# Altium schematic sheet JETSON_V2.SchDoc
size D; SheetNumber: 7; SheetTotal: 19
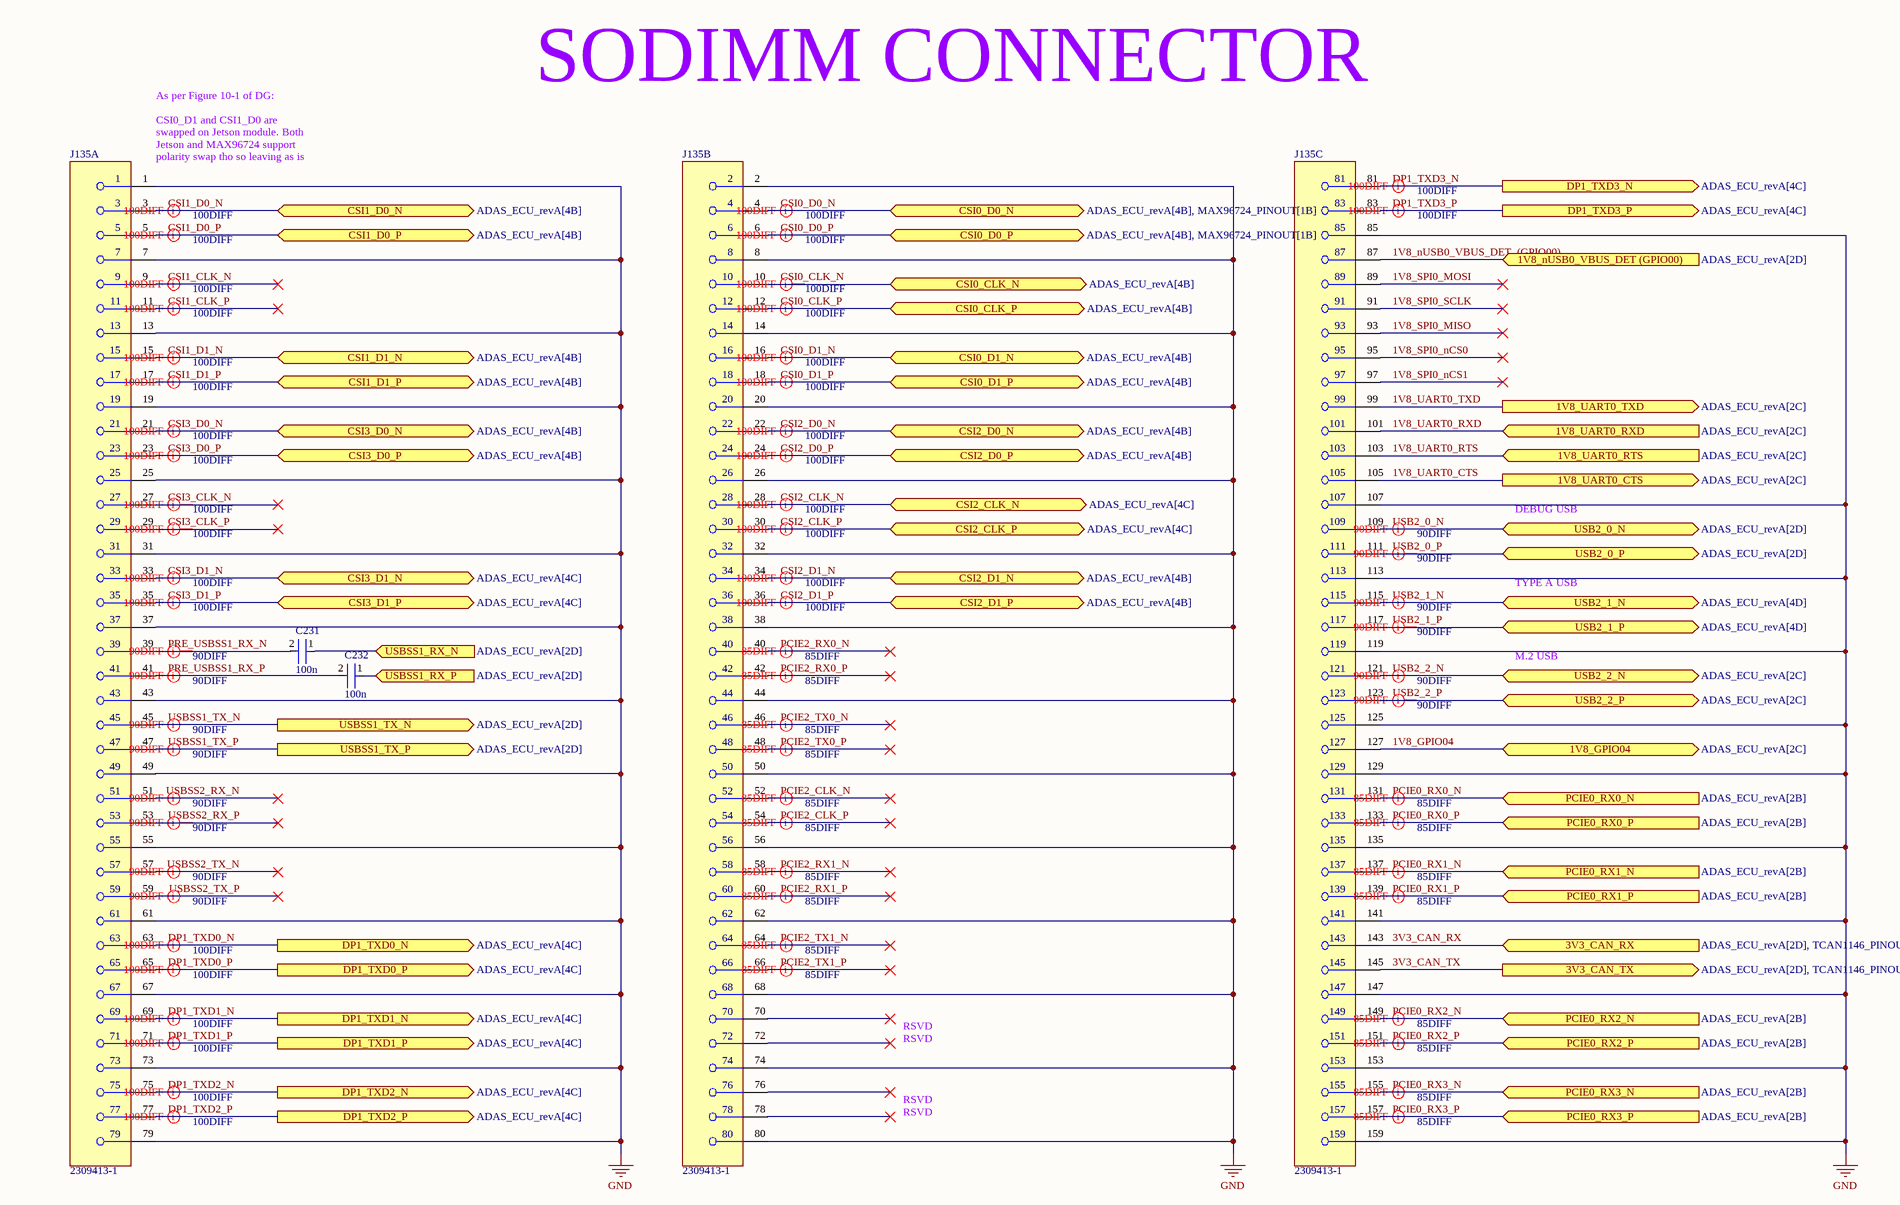
[diagram p0: JETSON_V2.SchDoc, top left]
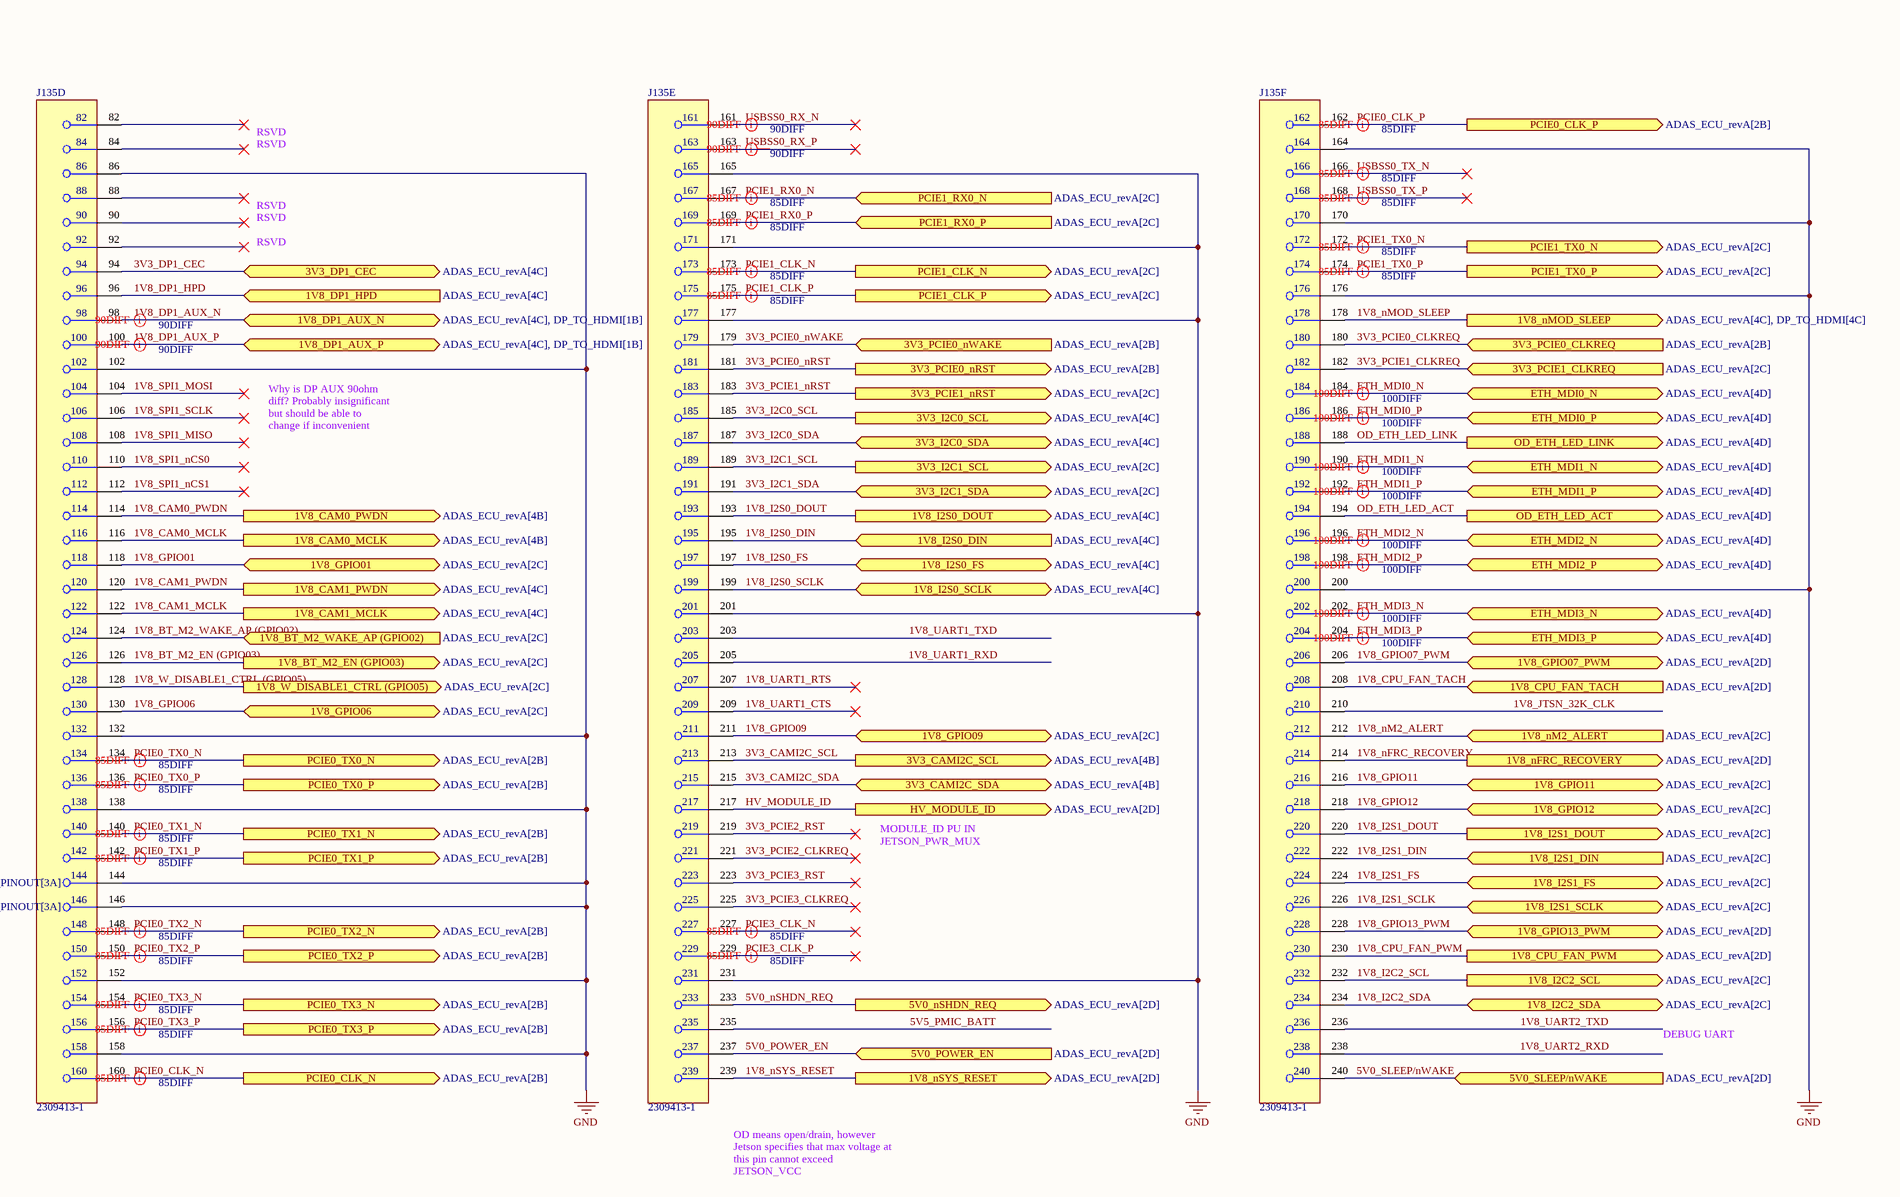
[diagram p1: JETSON_V2.SchDoc, top right]
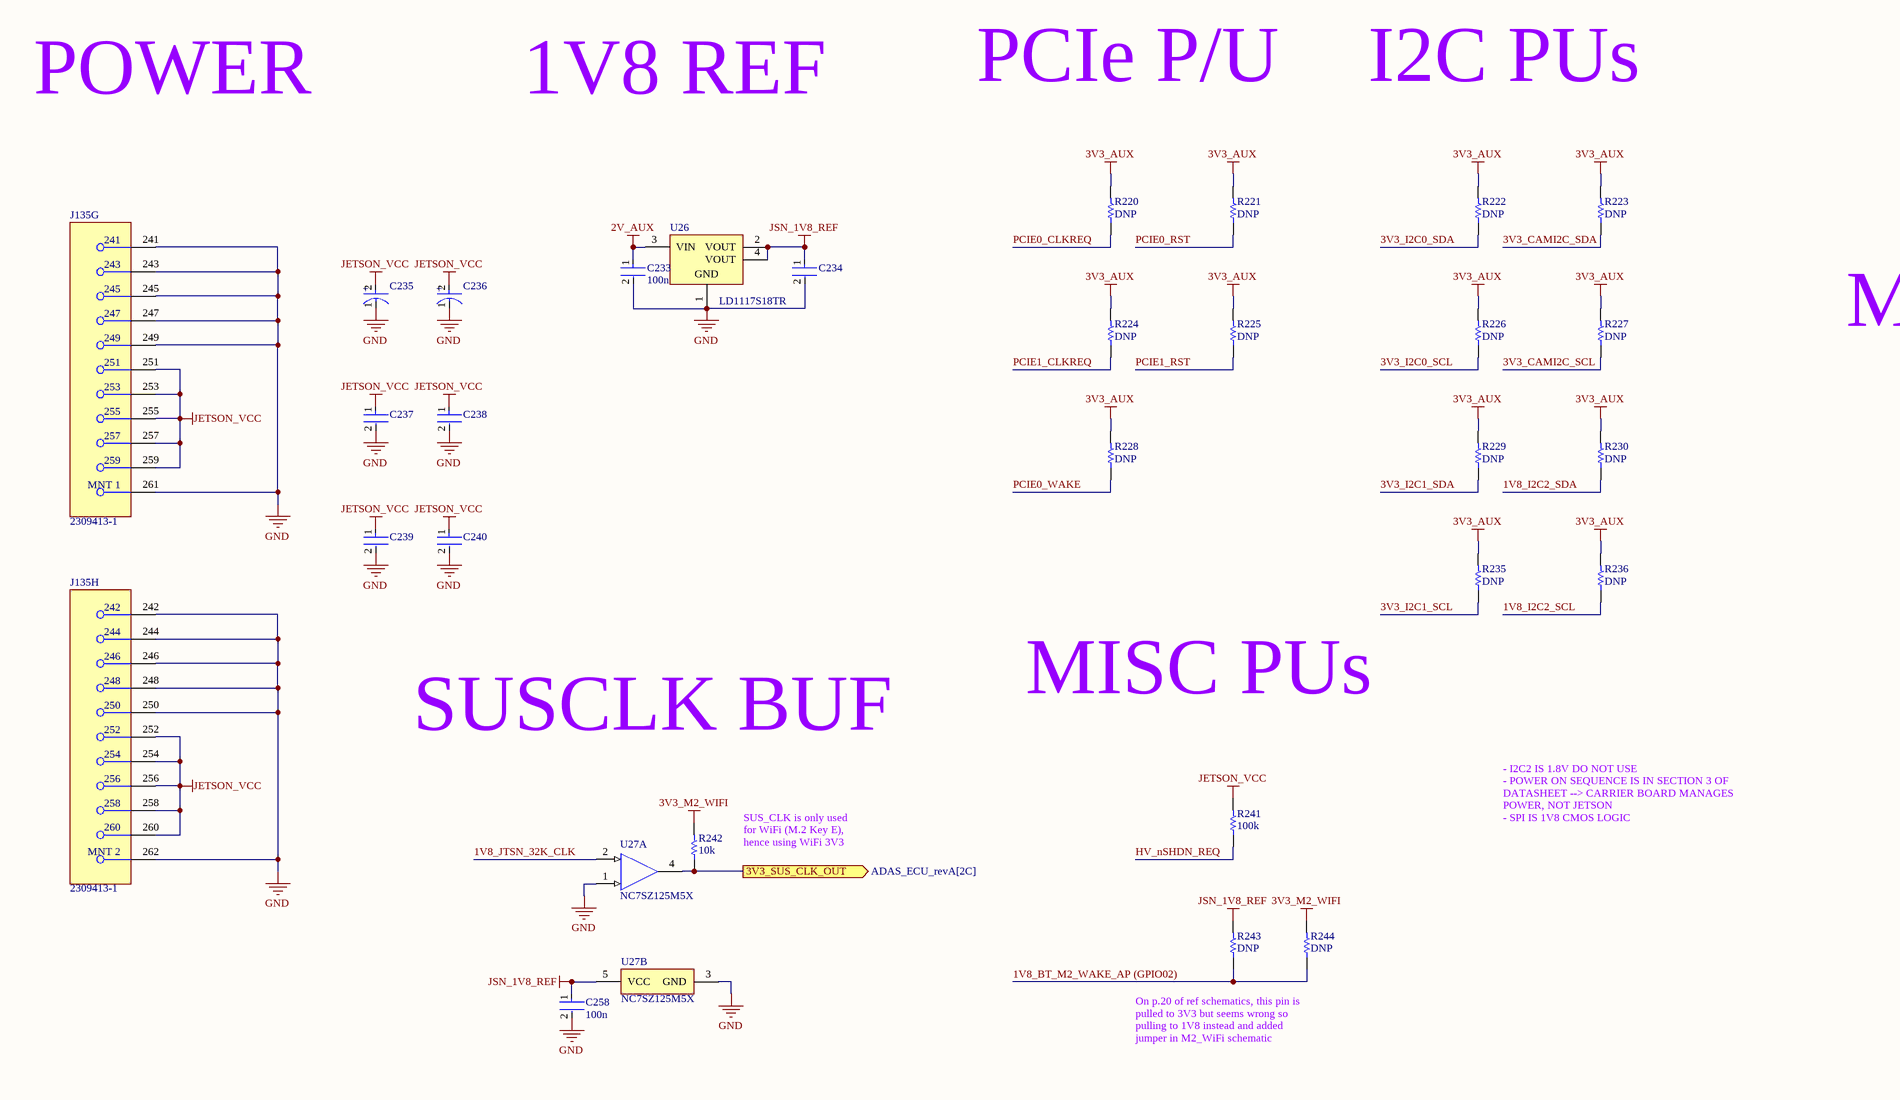
[diagram p2: JETSON_V2.SchDoc, bottom left]
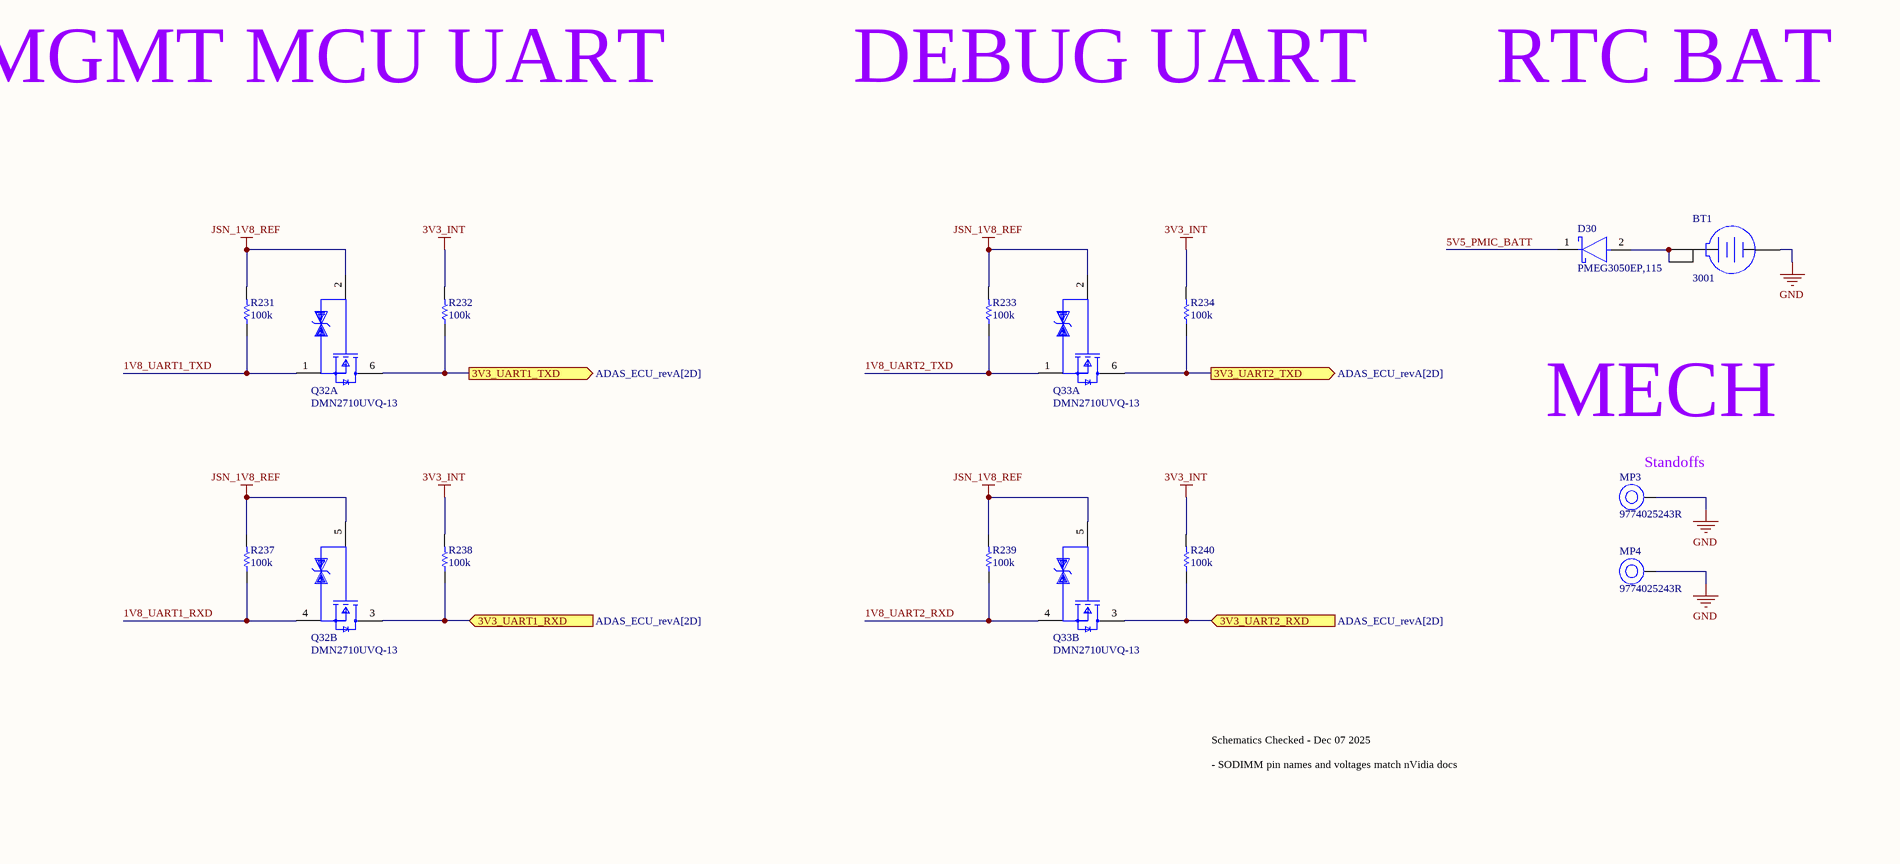
[diagram p3: JETSON_V2.SchDoc, bottom right]

## Parts
BT1  3001  [KSTN-3001_V]
C231  100n  [FP-0402-L_1_0_0_05-W_0_5-IPC_A]
C232  100n  [FP-0402-L_1_0_0_05-W_0_5-IPC_A]
C233  100n  [FP-0402-L_1_0_0_05-W_0_5-IPC_A]
C234  GRM188R60J106ME47D  [FP-GRM188-0_1-e0_2_0_55-IPC_A]  (value not drawn)
C235  T491X107K025AT  [FP-T491X107K025AT-MFG]  (value not drawn)
C236  T491X107K025AT  [FP-T491X107K025AT-MFG]  (value not drawn)
C237  12103D106KAT2A  [FP-1210-L_3_3_0_4-W_2_5_0-MFG]  (value not drawn)
C238  12103D106KAT2A  [FP-1210-L_3_3_0_4-W_2_5_0-MFG]  (value not drawn)
C239  12103D106KAT2A  [FP-1210-L_3_3_0_4-W_2_5_0-MFG]  (value not drawn)
C240  12103D106KAT2A  [FP-1210-L_3_3_0_4-W_2_5_0-MFG]  (value not drawn)
C258  100n  [FP-0402-L_1_0_0_05-W_0_5-IPC_A]
D30  PMEG3050EP,115  [FP-SOD128-MFG]
J135  2309413-1  [FP-2309413-1-MFG]  (parts A,B,C,D,E,F,G,H of 8)
MP3  9774025243R  [9774025243]
MP4  9774025243R  [9774025243]
Q32  DMN2710UVQ-13  [SOTFL50P162X60-6N]  (parts A,B of 2)
Q33  DMN2710UVQ-13  [SOTFL50P162X60-6N]  (parts A,B of 2)
R220  DNP  [R0603B]
R221  DNP  [R0603B]
R222  DNP  [R0603B]
R223  DNP  [R0603B]
R224  DNP  [R0603B]
R225  DNP  [R0603B]
R226  DNP  [R0603B]
R227  DNP  [R0603B]
R228  DNP  [R0603B]
R229  DNP  [R0603B]
R230  DNP  [R0603B]
R231  100k  [R0603B]
R232  100k  [R0603B]
R233  100k  [R0603B]
R234  100k  [R0603B]
R235  DNP  [R0603B]
R236  DNP  [R0603B]
R237  100k  [R0603B]
R238  100k  [R0603B]
R239  100k  [R0603B]
R240  100k  [R0603B]
R241  100k  [R0603B]
R242  10k  [R0603B]
R243  DNP  [R0603B]
R244  DNP  [R0603B]
U26  LD1117S18TR  [SOT-223_M]
U27  NC7SZ125M5X  [FAIR-SOT23-5_V]  (parts A,B of 2)

## Ports
1V8_BT_M2_EN (GPIO03) (out, see ADAS_ECU_revA[2C]), 1V8_BT_M2_WAKE_AP (GPIO02) (in, see ADAS_ECU_revA[2C]), 1V8_CAM0_MCLK (out, see ADAS_ECU_revA[4B]), 1V8_CAM0_PWDN (out, see ADAS_ECU_revA[4B]), 1V8_CAM1_MCLK (out, see ADAS_ECU_revA[4C]), 1V8_CAM1_PWDN (out, see ADAS_ECU_revA[4C]), 1V8_CPU_FAN_PWM (out, see ADAS_ECU_revA[2D]), 1V8_CPU_FAN_TACH (in, see ADAS_ECU_revA[2D]), 1V8_DP1_AUX_N (bidir, see ADAS_ECU_revA[4C], DP_TO_HDMI[1B]), 1V8_DP1_AUX_P (bidir, see ADAS_ECU_revA[4C], DP_TO_HDMI[1B]), 1V8_DP1_HPD (in, see ADAS_ECU_revA[4C]), 1V8_GPIO01 (bidir, see ADAS_ECU_revA[2C]), 1V8_GPIO04 (bidir, see ADAS_ECU_revA[2C]), 1V8_GPIO06 (bidir, see ADAS_ECU_revA[2C]), 1V8_GPIO07_PWM (bidir, see ADAS_ECU_revA[2D]), 1V8_GPIO09 (bidir, see ADAS_ECU_revA[2C]), 1V8_GPIO11 (bidir, see ADAS_ECU_revA[2C]), 1V8_GPIO12 (bidir, see ADAS_ECU_revA[2C]), 1V8_GPIO13_PWM (bidir, see ADAS_ECU_revA[2D]), 1V8_I2C2_SCL (out, see ADAS_ECU_revA[2C]), 1V8_I2C2_SDA (bidir, see ADAS_ECU_revA[2C]), 1V8_I2S0_DIN (in, see ADAS_ECU_revA[4C]), 1V8_I2S0_DOUT (out, see ADAS_ECU_revA[4C]), 1V8_I2S0_FS (bidir, see ADAS_ECU_revA[4C]), 1V8_I2S0_SCLK (bidir, see ADAS_ECU_revA[4C]), 1V8_I2S1_DIN (in, see ADAS_ECU_revA[2C]), 1V8_I2S1_DOUT (out, see ADAS_ECU_revA[2C]), 1V8_I2S1_FS (bidir, see ADAS_ECU_revA[2C]), 1V8_I2S1_SCLK (bidir, see ADAS_ECU_revA[2C]), 1V8_nFRC_RECOVERY (out, see ADAS_ECU_revA[2D]), 1V8_nM2_ALERT (in, see ADAS_ECU_revA[2C]), 1V8_nMOD_SLEEP (out, see ADAS_ECU_revA[4C], DP_TO_HDMI[4C]), 1V8_nSYS_RESET (out, see ADAS_ECU_revA[2D]), 1V8_nUSB0_VBUS_DET (GPIO00) (in, see ADAS_ECU_revA[2D]), 1V8_UART0_CTS (out, see ADAS_ECU_revA[2C]), 1V8_UART0_RTS (in, see ADAS_ECU_revA[2C]), 1V8_UART0_RXD (in, see ADAS_ECU_revA[2C]), 1V8_UART0_TXD (out, see ADAS_ECU_revA[2C]), 1V8_W_DISABLE1_CTRL (GPIO05) (out, see ADAS_ECU_revA[2C]), 3V3_CAMI2C_SCL (out, see ADAS_ECU_revA[4B]), 3V3_CAMI2C_SDA (bidir, see ADAS_ECU_revA[4B]), 3V3_CAN_RX (in, see ADAS_ECU_revA[2D], TCAN1146_PINOUT[3A]), 3V3_CAN_TX (out, see ADAS_ECU_revA[2D], TCAN1146_PINOUT[3A]), 3V3_DP1_CEC (bidir, see ADAS_ECU_revA[4C]), 3V3_I2C0_SCL (out, see ADAS_ECU_revA[4C]), 3V3_I2C0_SDA (bidir, see ADAS_ECU_revA[4C]), 3V3_I2C1_SCL (out, see ADAS_ECU_revA[2C]), 3V3_I2C1_SDA (bidir, see ADAS_ECU_revA[2C]), 3V3_PCIE0_CLKREQ (in, see ADAS_ECU_revA[2B]), 3V3_PCIE0_nRST (out, see ADAS_ECU_revA[2B]), 3V3_PCIE0_nWAKE (in, see ADAS_ECU_revA[2B]), 3V3_PCIE1_CLKREQ (in, see ADAS_ECU_revA[2C]), 3V3_PCIE1_nRST (out, see ADAS_ECU_revA[2C]), 3V3_SUS_CLK_OUT (out, see ADAS_ECU_revA[2C]), 3V3_UART1_RXD (in, see ADAS_ECU_revA[2D]), 3V3_UART1_TXD (out, see ADAS_ECU_revA[2D]), 3V3_UART2_RXD (in, see ADAS_ECU_revA[2D]), 3V3_UART2_TXD (out, see ADAS_ECU_revA[2D]), 5V0_nSHDN_REQ (out, see ADAS_ECU_revA[2D]), 5V0_POWER_EN (in, see ADAS_ECU_revA[2D]), 5V0_SLEEP/nWAKE (in, see ADAS_ECU_revA[2D]), CSI0_CLK_N (bidir, see ADAS_ECU_revA[4B]), CSI0_CLK_P (bidir, see ADAS_ECU_revA[4B]), CSI0_D0_N (bidir, see ADAS_ECU_revA[4B], MAX96724_PINOUT[1B]), CSI0_D0_P (bidir, see ADAS_ECU_revA[4B], MAX96724_PINOUT[1B]), CSI0_D1_N (bidir, see ADAS_ECU_revA[4B]), CSI0_D1_P (bidir, see ADAS_ECU_revA[4B]), CSI1_D0_N (bidir, see ADAS_ECU_revA[4B]), CSI1_D0_P (bidir, see ADAS_ECU_revA[4B]), CSI1_D1_N (bidir, see ADAS_ECU_revA[4B]), CSI1_D1_P (bidir, see ADAS_ECU_revA[4B]), CSI2_CLK_N (bidir, see ADAS_ECU_revA[4C]), CSI2_CLK_P (bidir, see ADAS_ECU_revA[4C]), CSI2_D0_N (bidir, see ADAS_ECU_revA[4B]), CSI2_D0_P (bidir, see ADAS_ECU_revA[4B]), CSI2_D1_N (bidir, see ADAS_ECU_revA[4B]), CSI2_D1_P (bidir, see ADAS_ECU_revA[4B]), CSI3_D0_N (bidir, see ADAS_ECU_revA[4B]), CSI3_D0_P (bidir, see ADAS_ECU_revA[4B]), CSI3_D1_N (bidir, see ADAS_ECU_revA[4C]), CSI3_D1_P (bidir, see ADAS_ECU_revA[4C]), DP1_TXD0_N (out, see ADAS_ECU_revA[4C]), DP1_TXD0_P (out, see ADAS_ECU_revA[4C]), DP1_TXD1_N (out, see ADAS_ECU_revA[4C]), DP1_TXD1_P (out, see ADAS_ECU_revA[4C]), DP1_TXD2_N (out, see ADAS_ECU_revA[4C]), DP1_TXD2_P (out, see ADAS_ECU_revA[4C]), DP1_TXD3_N (out, see ADAS_ECU_revA[4C]), DP1_TXD3_P (out, see ADAS_ECU_revA[4C]), ETH_MDI0_N (bidir, see ADAS_ECU_revA[4D]), ETH_MDI0_P (bidir, see ADAS_ECU_revA[4D]), ETH_MDI1_N (bidir, see ADAS_ECU_revA[4D]), ETH_MDI1_P (bidir, see ADAS_ECU_revA[4D]), ETH_MDI2_N (bidir, see ADAS_ECU_revA[4D]), ETH_MDI2_P (bidir, see ADAS_ECU_revA[4D]), ETH_MDI3_N (bidir, see ADAS_ECU_revA[4D]), ETH_MDI3_P (bidir, see ADAS_ECU_revA[4D]), HV_MODULE_ID (out, see ADAS_ECU_revA[2D]), OD_ETH_LED_ACT (out, see ADAS_ECU_revA[4D]), OD_ETH_LED_LINK (out, see ADAS_ECU_revA[4D]), PCIE0_CLK_N (out, see ADAS_ECU_revA[2B]), PCIE0_CLK_P (out, see ADAS_ECU_revA[2B]), PCIE0_RX0_N (in, see ADAS_ECU_revA[2B]), PCIE0_RX0_P (in, see ADAS_ECU_revA[2B]), PCIE0_RX1_N (in, see ADAS_ECU_revA[2B]), PCIE0_RX1_P (in, see ADAS_ECU_revA[2B]), PCIE0_RX2_N (in, see ADAS_ECU_revA[2B]), PCIE0_RX2_P (in, see ADAS_ECU_revA[2B]), PCIE0_RX3_N (in, see ADAS_ECU_revA[2B]), PCIE0_RX3_P (in, see ADAS_ECU_revA[2B]), PCIE0_TX0_N (out, see ADAS_ECU_revA[2B]), PCIE0_TX0_P (out, see ADAS_ECU_revA[2B]), PCIE0_TX1_N (out, see ADAS_ECU_revA[2B]), PCIE0_TX1_P (out, see ADAS_ECU_revA[2B]), PCIE0_TX2_N (out, see ADAS_ECU_revA[2B]), PCIE0_TX2_P (out, see ADAS_ECU_revA[2B]), PCIE0_TX3_N (out, see ADAS_ECU_revA[2B]), PCIE0_TX3_P (out, see ADAS_ECU_revA[2B]), PCIE1_CLK_N (out, see ADAS_ECU_revA[2C]), PCIE1_CLK_P (out, see ADAS_ECU_revA[2C]), PCIE1_RX0_N (in, see ADAS_ECU_revA[2C]), PCIE1_RX0_P (in, see ADAS_ECU_revA[2C]), PCIE1_TX0_N (out, see ADAS_ECU_revA[2C]), PCIE1_TX0_P (out, see ADAS_ECU_revA[2C]), USB2_0_N (bidir, see ADAS_ECU_revA[2D]), USB2_0_P (bidir, see ADAS_ECU_revA[2D]), USB2_1_N (bidir, see ADAS_ECU_revA[4D]), USB2_1_P (bidir, see ADAS_ECU_revA[4D]), USB2_2_N (bidir, see ADAS_ECU_revA[2C]), USB2_2_P (bidir, see ADAS_ECU_revA[2C]), USBSS1_RX_N (in, see ADAS_ECU_revA[2D]), USBSS1_RX_P (in, see ADAS_ECU_revA[2D]), USBSS1_TX_N (out, see ADAS_ECU_revA[2D]), USBSS1_TX_P (out, see ADAS_ECU_revA[2D])

## Nets
2V_AUX: C233.1 U26.3(VIN)
3V3_AUX: R220.2 R221.2 R222.2 R223.2 R224.2 R225.2 R226.2 R227.2 R228.2 R229.2 R230.2 R235.2 R236.2
3V3_INT: R232.2 R234.2 R238.2 R240.2
3V3_M2_WIFI: R242.2 R244.2
GND: BT1.3(-) C233.2 C234.2 C235.1(C) C236.1(C) C237.2 C238.2 C239.2 C240.2 C258.2 J135.1 J135.2 J135.7 J135.8 J135.13 J135.14 J135.19 J135.20 J135.25 J135.26 J135.31 J135.32 J135.37 J135.38 J135.43 J135.44 J135.49 J135.50 J135.55 J135.56 J135.61 J135.62 J135.67 J135.68 J135.73 J135.74 J135.79 J135.80 J135.85 J135.86 J135.102 J135.107 J135.113 J135.119 J135.125 J135.129 J135.132 J135.135 J135.138 J135.141 J135.144 J135.146 J135.147 J135.152 J135.153 J135.158 J135.159 J135.164 J135.165 J135.170 J135.171 J135.176 J135.177 J135.200 J135.201 J135.231 J135.241 J135.242 J135.243 J135.244 J135.245 J135.246 J135.247 J135.248 J135.249 J135.250 J135.261(MNT_1) J135.262(MNT_2) MP3.1 MP4.1 U26.1(GND) U27.1(~{OE}) U27.3(GND)
JETSON_VCC: C235.2(A) C236.2(A) C237.1 C238.1 C239.1 C240.1 J135.251 J135.252 J135.253 J135.254 J135.255 J135.256 J135.257 J135.258 J135.259 J135.260 R241.2
JSN_1V8_REF: C234.1 C258.1 Q32.2(Gate1) Q32.5(Gate2) Q33.2(Gate1) Q33.5(Gate2) R231.2 R233.2 R237.2 R239.2 R243.2 U26.2(VOUT) U26.4(VOUT) U27.5(VCC)
1V8_BT_M2_EN (GPIO03): J135.126 ; port 1V8_BT_M2_EN (GPIO03)
1V8_BT_M2_WAKE_AP (GPIO02): J135.124 R243.1 R244.1 ; port 1V8_BT_M2_WAKE_AP (GPIO02)
1V8_CAM0_MCLK: J135.116 ; port 1V8_CAM0_MCLK
1V8_CAM0_PWDN: J135.114 ; port 1V8_CAM0_PWDN
1V8_CAM1_MCLK: J135.122 ; port 1V8_CAM1_MCLK
1V8_CAM1_PWDN: J135.120 ; port 1V8_CAM1_PWDN
1V8_CPU_FAN_PWM: J135.230 ; port 1V8_CPU_FAN_PWM
1V8_CPU_FAN_TACH: J135.208 ; port 1V8_CPU_FAN_TACH
1V8_DP1_AUX_N: J135.98 ; port 1V8_DP1_AUX_N
1V8_DP1_AUX_P: J135.100 ; port 1V8_DP1_AUX_P
1V8_DP1_HPD: J135.96 ; port 1V8_DP1_HPD
1V8_GPIO01: J135.118 ; port 1V8_GPIO01
1V8_GPIO04: J135.127 ; port 1V8_GPIO04
1V8_GPIO06: J135.130 ; port 1V8_GPIO06
1V8_GPIO07_PWM: J135.206 ; port 1V8_GPIO07_PWM
1V8_GPIO09: J135.211 ; port 1V8_GPIO09
1V8_GPIO11: J135.216 ; port 1V8_GPIO11
1V8_GPIO12: J135.218 ; port 1V8_GPIO12
1V8_GPIO13_PWM: J135.228 ; port 1V8_GPIO13_PWM
1V8_I2C2_SCL: J135.232 R236.1 ; port 1V8_I2C2_SCL
1V8_I2C2_SDA: J135.234 R230.1 ; port 1V8_I2C2_SDA
1V8_I2S0_DIN: J135.195 ; port 1V8_I2S0_DIN
1V8_I2S0_DOUT: J135.193 ; port 1V8_I2S0_DOUT
1V8_I2S0_FS: J135.197 ; port 1V8_I2S0_FS
1V8_I2S0_SCLK: J135.199 ; port 1V8_I2S0_SCLK
1V8_I2S1_DIN: J135.222 ; port 1V8_I2S1_DIN
1V8_I2S1_DOUT: J135.220 ; port 1V8_I2S1_DOUT
1V8_I2S1_FS: J135.224 ; port 1V8_I2S1_FS
1V8_I2S1_SCLK: J135.226 ; port 1V8_I2S1_SCLK
1V8_JTSN_32K_CLK: J135.210 U27.2(A)
1V8_nFRC_RECOVERY: J135.214 ; port 1V8_nFRC_RECOVERY
1V8_nM2_ALERT: J135.212 ; port 1V8_nM2_ALERT
1V8_nMOD_SLEEP: J135.178 ; port 1V8_nMOD_SLEEP
1V8_nSYS_RESET: J135.239 ; port 1V8_nSYS_RESET
1V8_nUSB0_VBUS_DET  (GPIO00): J135.87 ; port 1V8_nUSB0_VBUS_DET (GPIO00)
1V8_SPI0_MISO: J135.93
1V8_SPI0_MOSI: J135.89
1V8_SPI0_nCS0: J135.95
1V8_SPI0_nCS1: J135.97
1V8_SPI0_SCLK: J135.91
1V8_SPI1_MISO: J135.108
1V8_SPI1_MOSI: J135.104
1V8_SPI1_nCS0: J135.110
1V8_SPI1_nCS1: J135.112
1V8_SPI1_SCLK: J135.106
1V8_UART0_CTS: J135.105 ; port 1V8_UART0_CTS
1V8_UART0_RTS: J135.103 ; port 1V8_UART0_RTS
1V8_UART0_RXD: J135.101 ; port 1V8_UART0_RXD
1V8_UART0_TXD: J135.99 ; port 1V8_UART0_TXD
1V8_UART1_CTS: J135.209
1V8_UART1_RTS: J135.207
1V8_UART1_RXD: J135.205 Q32.4(Source2) R237.1
1V8_UART1_TXD: J135.203 Q32.1(Source1) R231.1
1V8_UART2_RXD: J135.238 Q33.4(Source2) R239.1
1V8_UART2_TXD: J135.236 Q33.1(Source1) R233.1
1V8_W_DISABLE1_CTRL (GPIO05): J135.128 ; port 1V8_W_DISABLE1_CTRL (GPIO05)
3V3_CAMI2C_SCL: J135.213 R227.1 ; port 3V3_CAMI2C_SCL
3V3_CAMI2C_SDA: J135.215 R223.1 ; port 3V3_CAMI2C_SDA
3V3_CAN_RX: J135.143 ; port 3V3_CAN_RX
3V3_CAN_TX: J135.145 ; port 3V3_CAN_TX
3V3_DP1_CEC: J135.94 ; port 3V3_DP1_CEC
3V3_I2C0_SCL: J135.185 R226.1 ; port 3V3_I2C0_SCL
3V3_I2C0_SDA: J135.187 R222.1 ; port 3V3_I2C0_SDA
3V3_I2C1_SCL: J135.189 R235.1 ; port 3V3_I2C1_SCL
3V3_I2C1_SDA: J135.191 R229.1 ; port 3V3_I2C1_SDA
3V3_PCIE0_CLKREQ: J135.180 ; port 3V3_PCIE0_CLKREQ
3V3_PCIE0_nRST: J135.181 ; port 3V3_PCIE0_nRST
3V3_PCIE0_nWAKE: J135.179 ; port 3V3_PCIE0_nWAKE
3V3_PCIE1_CLKREQ: J135.182 ; port 3V3_PCIE1_CLKREQ
3V3_PCIE1_nRST: J135.183 ; port 3V3_PCIE1_nRST
3V3_PCIE2_CLKREQ: J135.221
3V3_PCIE2_RST: J135.219
3V3_PCIE3_CLKREQ: J135.225
3V3_PCIE3_RST: J135.223
3V3_SUS_CLK_OUT: R242.1 U27.4(Y) ; port 3V3_SUS_CLK_OUT
3V3_UART1_RXD: Q32.3(Drain2) R238.1 ; port 3V3_UART1_RXD
3V3_UART1_TXD: Q32.6(Drain1) R232.1 ; port 3V3_UART1_TXD
3V3_UART2_RXD: Q33.3(Drain2) R240.1 ; port 3V3_UART2_RXD
3V3_UART2_TXD: Q33.6(Drain1) R234.1 ; port 3V3_UART2_TXD
5V0_nSHDN_REQ: J135.233 ; port 5V0_nSHDN_REQ
5V0_POWER_EN: J135.237 ; port 5V0_POWER_EN
5V0_SLEEP/nWAKE: J135.240 ; port 5V0_SLEEP/nWAKE
5V5_PMIC_BATT: D30.1(C) J135.235
CSI0_CLK_N: J135.10 ; port CSI0_CLK_N
CSI0_CLK_P: J135.12 ; port CSI0_CLK_P
CSI0_D0_N: J135.4 ; port CSI0_D0_N
CSI0_D0_P: J135.6 ; port CSI0_D0_P
CSI0_D1_N: J135.16 ; port CSI0_D1_N
CSI0_D1_P: J135.18 ; port CSI0_D1_P
CSI1_CLK_N: J135.9
CSI1_CLK_P: J135.11
CSI1_D0_N: J135.3 ; port CSI1_D0_N
CSI1_D0_P: J135.5 ; port CSI1_D0_P
CSI1_D1_N: J135.15 ; port CSI1_D1_N
CSI1_D1_P: J135.17 ; port CSI1_D1_P
CSI2_CLK_N: J135.28 ; port CSI2_CLK_N
CSI2_CLK_P: J135.30 ; port CSI2_CLK_P
CSI2_D0_N: J135.22 ; port CSI2_D0_N
CSI2_D0_P: J135.24 ; port CSI2_D0_P
CSI2_D1_N: J135.34 ; port CSI2_D1_N
CSI2_D1_P: J135.36 ; port CSI2_D1_P
CSI3_CLK_N: J135.27
CSI3_CLK_P: J135.29
CSI3_D0_N: J135.21 ; port CSI3_D0_N
CSI3_D0_P: J135.23 ; port CSI3_D0_P
CSI3_D1_N: J135.33 ; port CSI3_D1_N
CSI3_D1_P: J135.35 ; port CSI3_D1_P
DP1_TXD0_N: J135.63 ; port DP1_TXD0_N
DP1_TXD0_P: J135.65 ; port DP1_TXD0_P
DP1_TXD1_N: J135.69 ; port DP1_TXD1_N
DP1_TXD1_P: J135.71 ; port DP1_TXD1_P
DP1_TXD2_N: J135.75 ; port DP1_TXD2_N
DP1_TXD2_P: J135.77 ; port DP1_TXD2_P
DP1_TXD3_N: J135.81 ; port DP1_TXD3_N
DP1_TXD3_P: J135.83 ; port DP1_TXD3_P
ETH_MDI0_N: J135.184 ; port ETH_MDI0_N
ETH_MDI0_P: J135.186 ; port ETH_MDI0_P
ETH_MDI1_N: J135.190 ; port ETH_MDI1_N
ETH_MDI1_P: J135.192 ; port ETH_MDI1_P
ETH_MDI2_N: J135.196 ; port ETH_MDI2_N
ETH_MDI2_P: J135.198 ; port ETH_MDI2_P
ETH_MDI3_N: J135.202 ; port ETH_MDI3_N
ETH_MDI3_P: J135.204 ; port ETH_MDI3_P
HV_MODULE_ID: J135.217 ; port HV_MODULE_ID
HV_nSHDN_REQ: R241.1
OD_ETH_LED_ACT: J135.194 ; port OD_ETH_LED_ACT
OD_ETH_LED_LINK: J135.188 ; port OD_ETH_LED_LINK
PCIE0_CLK_N: J135.160 ; port PCIE0_CLK_N
PCIE0_CLK_P: J135.162 ; port PCIE0_CLK_P
PCIE0_CLKREQ: R220.1
PCIE0_RST: R221.1
PCIE0_RX0_N: J135.131 ; port PCIE0_RX0_N
PCIE0_RX0_P: J135.133 ; port PCIE0_RX0_P
PCIE0_RX1_N: J135.137 ; port PCIE0_RX1_N
PCIE0_RX1_P: J135.139 ; port PCIE0_RX1_P
PCIE0_RX2_N: J135.149 ; port PCIE0_RX2_N
PCIE0_RX2_P: J135.151 ; port PCIE0_RX2_P
PCIE0_RX3_N: J135.155 ; port PCIE0_RX3_N
PCIE0_RX3_P: J135.157 ; port PCIE0_RX3_P
PCIE0_TX0_N: J135.134 ; port PCIE0_TX0_N
PCIE0_TX0_P: J135.136 ; port PCIE0_TX0_P
PCIE0_TX1_N: J135.140 ; port PCIE0_TX1_N
PCIE0_TX1_P: J135.142 ; port PCIE0_TX1_P
PCIE0_TX2_N: J135.148 ; port PCIE0_TX2_N
PCIE0_TX2_P: J135.150 ; port PCIE0_TX2_P
PCIE0_TX3_N: J135.154 ; port PCIE0_TX3_N
PCIE0_TX3_P: J135.156 ; port PCIE0_TX3_P
PCIE0_WAKE: R228.1
PCIE1_CLK_N: J135.173 ; port PCIE1_CLK_N
PCIE1_CLK_P: J135.175 ; port PCIE1_CLK_P
PCIE1_CLKREQ: R224.1
PCIE1_RST: R225.1
PCIE1_RX0_N: J135.167 ; port PCIE1_RX0_N
PCIE1_RX0_P: J135.169 ; port PCIE1_RX0_P
PCIE1_TX0_N: J135.172 ; port PCIE1_TX0_N
PCIE1_TX0_P: J135.174 ; port PCIE1_TX0_P
PCIE2_CLK_N: J135.52
PCIE2_CLK_P: J135.54
PCIE2_RX0_N: J135.40
PCIE2_RX0_P: J135.42
PCIE2_RX1_N: J135.58
PCIE2_RX1_P: J135.60
PCIE2_TX0_N: J135.46
PCIE2_TX0_P: J135.48
PCIE2_TX1_N: J135.64
PCIE2_TX1_P: J135.66
PCIE3_CLK_N: J135.227
PCIE3_CLK_P: J135.229
PRE_USBSS1_RX_N: C231.2 J135.39
PRE_USBSS1_RX_P: C232.2 J135.41
USB2_0_N: J135.109 ; port USB2_0_N
USB2_0_P: J135.111 ; port USB2_0_P
USB2_1_N: J135.115 ; port USB2_1_N
USB2_1_P: J135.117 ; port USB2_1_P
USB2_2_N: J135.121 ; port USB2_2_N
USB2_2_P: J135.123 ; port USB2_2_P
USBSS0_RX_N: J135.161
USBSS0_RX_P: J135.163
USBSS0_TX_N: J135.166
USBSS0_TX_P: J135.168
USBSS1_RX_N: C231.1 ; port USBSS1_RX_N
USBSS1_RX_P: C232.1 ; port USBSS1_RX_P
USBSS1_TX_N: J135.45 ; port USBSS1_TX_N
USBSS1_TX_P: J135.47 ; port USBSS1_TX_P
USBSS2_RX_N: J135.51
USBSS2_RX_P: J135.53
USBSS2_TX_N: J135.57
USBSS2_TX_P: J135.59
NetBT1_1: BT1.1(+) BT1.2(+) D30.2(A)

Not connected (* = marked no-connect by the designer): J135 70* 72* 76* 78* 82* 84* 88* 90* 92*

## Layout directives
differential pair; differential pair class 85DIFF: PCIE0_CLK_N, PCIE0_CLK_P, PCIE0_RX0_N, PCIE0_RX0_P, PCIE0_RX1_N, PCIE0_RX1_P, PCIE0_RX2_N, PCIE0_RX2_P, PCIE0_RX3_N, PCIE0_RX3_P, PCIE0_TX0_N, PCIE0_TX0_P, PCIE0_TX1_N, PCIE0_TX1_P, PCIE0_TX2_N, PCIE0_TX2_P, PCIE0_TX3_N, PCIE0_TX3_P, PCIE1_CLK_N, PCIE1_CLK_P, PCIE1_RX0_N, PCIE1_RX0_P, PCIE1_TX0_N, PCIE1_TX0_P, PCIE2_CLK_N, PCIE2_CLK_P, PCIE2_RX0_N, PCIE2_RX0_P, PCIE2_RX1_N, PCIE2_RX1_P, PCIE2_TX0_N, PCIE2_TX0_P, PCIE2_TX1_N, PCIE2_TX1_P, PCIE3_CLK_N, PCIE3_CLK_P, USBSS0_TX_N, USBSS0_TX_P
differential pair; differential pair class 100DIFF: CSI0_CLK_N, CSI0_CLK_P, CSI0_D0_N, CSI0_D0_P, CSI0_D1_N, CSI0_D1_P, CSI1_CLK_N, CSI1_CLK_P, CSI1_D0_N, CSI1_D0_P, CSI1_D1_N, CSI1_D1_P, CSI2_CLK_N, CSI2_CLK_P, CSI2_D0_N, CSI2_D0_P, CSI2_D1_N, CSI2_D1_P, CSI3_CLK_N, CSI3_CLK_P, CSI3_D0_N, CSI3_D0_P, CSI3_D1_N, CSI3_D1_P, DP1_TXD0_N, DP1_TXD0_P, DP1_TXD1_N, DP1_TXD1_P, DP1_TXD2_N, DP1_TXD2_P, DP1_TXD3_N, DP1_TXD3_P, ETH_MDI0_N, ETH_MDI0_P, ETH_MDI1_N, ETH_MDI1_P, ETH_MDI2_N, ETH_MDI2_P, ETH_MDI3_N, ETH_MDI3_P
differential pair; differential pair class 90DIFF: 1V8_DP1_AUX_N, 1V8_DP1_AUX_P, PRE_USBSS1_RX_N, PRE_USBSS1_RX_P, USB2_0_N, USB2_0_P, USB2_1_N, USB2_1_P, USB2_2_N, USB2_2_P, USBSS0_RX_N, USBSS0_RX_P, USBSS1_TX_N, USBSS1_TX_P, USBSS2_RX_N, USBSS2_RX_P, USBSS2_TX_N, USBSS2_TX_P

## Notes on the sheet
- SODIMM CONNECTOR
- (near J135) As per Figure 10-1 of DG:
  CSI0_D1 and CSI1_D0 are swapped on Jetson module. Both Jetson and MAX96724 support polarity swap tho so leaving as is
- RSVD
  RSVD
- RSVD
- DEBUG USB
- Why is DP AUX 90ohm diff? Probably insignificant but should be able to change if inconvenient
- TYPE A USB
- M.2 USB
- MODULE_ID PU IN JETSON_PWR_MUX
- DEBUG UART
- OD means open/drain, however Jetson specifies that max voltage at this pin cannot exceed JETSON_VCC
- POWER
- 1V8 REF
- PCIe P/U
- I2C PUs
- MGMT MCU UART
- RTC BAT
- MECH
- SUSCLK BUF
- MISC PUs
- (near MP3) Standoffs
- - I2C2 IS 1.8V DO NOT USE
  - POWER ON SEQUENCE IS IN SECTION 3 OF DATASHEET --> CARRIER BOARD MANAGES POWER, NOT JETSON
  - SPI IS 1V8 CMOS LOGIC
- SUS_CLK is only used for WiFi (M.2 Key E), hence using WiFi 3V3
- On p.20 of ref schematics, this pin is pulled to 3V3 but seems wrong so pulling to 1V8 instead and added jumper in M2_WiFi schematic
- Schematics Checked - Dec 07 2025
  - SODIMM pin names and voltages match nVidia docs
- (in symbol CMP-2000-07204-2) +

## Library data of the parts
BT1 = CMP-2000-05463-1: Holder Battery Coin, 12 mm, 2-Pin THD, RoHS; Manufacturer: Keystone; Package Reference: 3001; Package Description: 2-Pin Through Hole Device, Body 13.21 x 12.07 mm; Datasheet Version: Rev. H, 09/2006; Datasheet URL: https://datasheet.ciiva.com/3/3001-3954.pdf; Mounting Technology: ThroughHole; Manufacturer URL: http://www.keyelco.com/
C231-C233 C258 = CMP-001-00058-1: LARGE PADS, 0402 CAP, CHANGE COMMENT TO MATCH REAL P/N; Capacitor Type: Ceramic; Min Operating Temperature: -55°C; Mounting Technology: Surface Mount; Pins: 2; Case/Package: 0402; RoHS Compliant: Yes; Max Operating Temperature: 85°C
C234 = CMP-2006-02792-2: Chip Multilayer Ceramic Capacitors for General Purpose, 0603, 10uF, X5R, 15%, 20%, 6.3V; Packaging: Tape and Reel; Voltage Rating (DC): 6.3V; Width: 0.031inch; Termination: SMD/SMT; Dielectric: X5R; Package Quantity: 4000; Voltage Rating: 6.3V; Capacitance: 10uF; Case/Package: 0603; Min Operating Temperature: -55°C; Voltage: 6.3V; Length: 1.6mm; Thickness: 0.035inch; Lead Free: Lead Free; Depth: 0.8mm; Case Code (Imperial): 0603; Max Operating Temperature: 85°C; Material: Ceramic; Height: 0.8mm; Tolerance: 20%; Mount: Surface Mount; REACH SVHC: No SVHC; Radiation Hardening: No; Case Code (Metric): 1608
C235 C236 = CMP-2000-07204-2: CAP TANT 100UF 10% 25V 2917; Leakage Current: 25uA; Ripple Current: 742mA; Polarity: Polar; Dissipation Factor: 8%; Life (Hours): 2000Hour; Dielectric Material: Tantalum; ESR (Equivalent Series Resistance): 300mR; Length: 7.3mm; RoHS Compliant: No; Failure Rate: 0.001%; REACH SVHC: No SVHC; Tolerance: 10%; Mount: Surface Mount; Height - Seated (Max): 0.169inch; Features: General Purpose; Height: 4mm; Package Quantity: 1; Case Code (Metric): 7343; Max Operating Temperature: 125°C; Number of Pins: 2; Radiation Hardening: No; Lead Free: Lead Free; Capacitance: 100uF; Termination: SMD/SMT; Voltage Rating: 25V; Series: T491; Depth: 4.3mm; Construction: Flat; Case/Package: 2917; Min Operating Temperature: -55°C; Voltage Rating (DC): 25V; Width: 4.3mm; Packaging: Tape and Reel; Case Code (Imperial): 2917; Voltage: 25V
C237-C240 = CMP-2000-05477-2: General Purpose Ceramic Capacitor, 1210, 10uF, 10%, X5R, 15%, 25V; Lead Free: Lead Free; Max Operating Temperature: 85°C; REACH SVHC: No SVHC; Depth: 2.5mm; Packaging: Tape and Reel; Min Operating Temperature: -55°C; Height: 2.29mm; Construction: Flat; Case Code (Imperial): 1210; Radiation Hardening: No; Voltage: 25V; Case/Package: 1210; Series: -; Dielectric: X5R; Length: 3.2mm; Thickness: 0.11inch; Package Quantity: 1; Termination: SMD/SMT; Case Code (Metric): 3225; Voltage Rating (DC): 25V; Voltage Rating: 25V; Contact Plating: Tin; RoHS Compliant: Yes; Mount: Surface Mount; Width: 0.098inch; Capacitance: 10uF; Tolerance: 10%
D30 = CMP-14398-000051-1: DIODE SCHOTTKY 30V 5A SOD128; RoHS Compliant: Yes
J135 = CMP-03356-000001-1: DDR4 SODIMM 260P 9.2H STD; Manufacturer: TE Connectivity; Voltage Rating: 25V; Current Rating: 0.5A; Is Female: yes; Pitch: 0.5mm; Memory Type: SDRAM,DDR; Conn Orientation: Horizontal; Number Of Contacts: 260; Temperature: -55°C to +85°C; Octopart: https://octopart.com/2309413-1-te+connectivity-84799194; Device Class L3: unset; Contact Material: Gold,Nickel; ComponentLink2URL: https://www.te.com/commerce/DocumentDelivery/DDEController?Action=showdoc&DocId=Specification+Or+Standard%7F108-115122%7FA1%7Fpdf%7FEnglish%7FENG_SS_108-115122_A1.pdf%7F2309413-1; Manufacturer Part Number: 2309413-1; ComponentLink2Description: Datasheet; Digikey Description: DDR4 SODIMM 260P 9.2H STD; Height: 18.8mm; Footprint Url: https://www.te.com/commerce/DocumentDelivery/DDEController?Action=showdoc&DocId=Customer+Drawing%7F2309413%7F4%7Fpdf%7FEnglish%7FENG_CD_2309413_4.pdf%7F2309413-1; Temperature Range Low: -55°C; Device Class L2: Memory Connectors; Temperature Range High: +85°C; RoHS: TRUE; Automotive: No; Device Class L1: Connectors; Mouser Description: Conn DDR4 DIMM Socket SKT 260 POS 0.5mm Solder RA SMD T/R; Category: Conn; Package: 0; Lead Free: Yes
MP3 MP4 = CMP-03913-59774857-1: 9774025243R Spacer Material: Steel, Tin-Plated Mounting: SMT Series: WA-SMST Thread D: M2; Outside Diameter: 4.3434mm; Threaded/Unthreaded: Threaded; Plating: Tin; REACH SVHC: Unknown; NexarPartId: 59774857; RoHS: Compliant; Material: Steel; Packaging: Tape and Reel; Max Operating Temperature: 150°C; Min Operating Temperature: -55°C; Length: 2.5mm; Height: 2.5mm
Q32 Q33 = CMP-013-00023-2: MOSFET Array, Dual N Channel, 20 V, 920 mA, 450 Milliohms, SOT-563, 6 Pins; Max Operating Temperature: 150°C; Min Operating Temperature: -55°C
R220-R244 = CMP-009-00002-14: Resistor
U26 = CMP-0244-00308-1: Fixed Low Drop Positive Voltage Regulator, 1.8V, 4-Pin SOT-223, Tape and Reel; ComponentLink1URL: http://www.st.com; PackageReference: SOT-223; PackageDescription: 4-Pin SOT-223 Package, 6.5 x 3.5 mm Body, 2.3 mm Pitch, 7 mm Lead Span; ComponentLink2URL: http://www.st.com/internet/com/TECHNICAL_RESOURCES/TECHNICAL_LITERATURE/DATASHEET/CD00000544.pdf; ComponentLink2Description: Datasheet; ComponentLink1Description: Manufacturer URL; DatasheetVersion: 1/11/2011; PackageVersion: 2010
U27 = CMP-2000-06816-1: TinyLogic UHS Buffer with Three-State Output, 1.65 to 5.5 V, -40 to 85 degC, 5-Pin SOT23, RoHS, Tape and Reel; Manufacturer: Fairchild Semiconductor; Input Signal Type: Single-Ended; Maximum Operating Supply Voltage: 5.5V; Number of Outputs per Chip: 1; Maximum Propagation Delay Time @ Maximum CL: 5.7@3.3V; Minimum Operating Supply Voltage: 1.65V; Maximum Quiescent Current: 2uA; Propagation Delay Test Condition: 50pF; Lead Finish: MatteTin; Number of Output Enables per Chip: 1Low; Maximum Low Level Output Current: 32mA; Output Type: 3-State; Package Version: 08/2015; Max Processing Temp: 260; Maximum High Level Output Current: -32mA; Tolerant I/Os: 5V; Bus Hold: No; Fabrication Technology: CMOS; Polarity: Non-Inverting; Typical Operating Supply Voltage: 1.8; Logic Function: Buffer/LineDriver; Manufacturer URL: https://www.fairchildsemi.com/; Mounting: SurfaceMount; Number of Channels per Chip: 1; Package Description: 5-Pin Small Outline Transistor, Body 2.9 x 1.6 mm, Pitch 0.95 mm; Package Reference: SOT23-5; Number of Elements per Chip: 1; Package URL: https://www.fairchildsemi.com/package-drawings/MA/MA05B.pdf; Datasheet URL: https://www.fairchildsemi.com/datasheets/NC/NC7SZ125.pdf; Datasheet Version: Rev. 1.0.5, 01/2014; Mounting Technology: SurfaceMount; Operating Temperature: -40to85C; Number of Inputs per Chip: 1